# Altium project plp-cd(4-20).PrjPcb
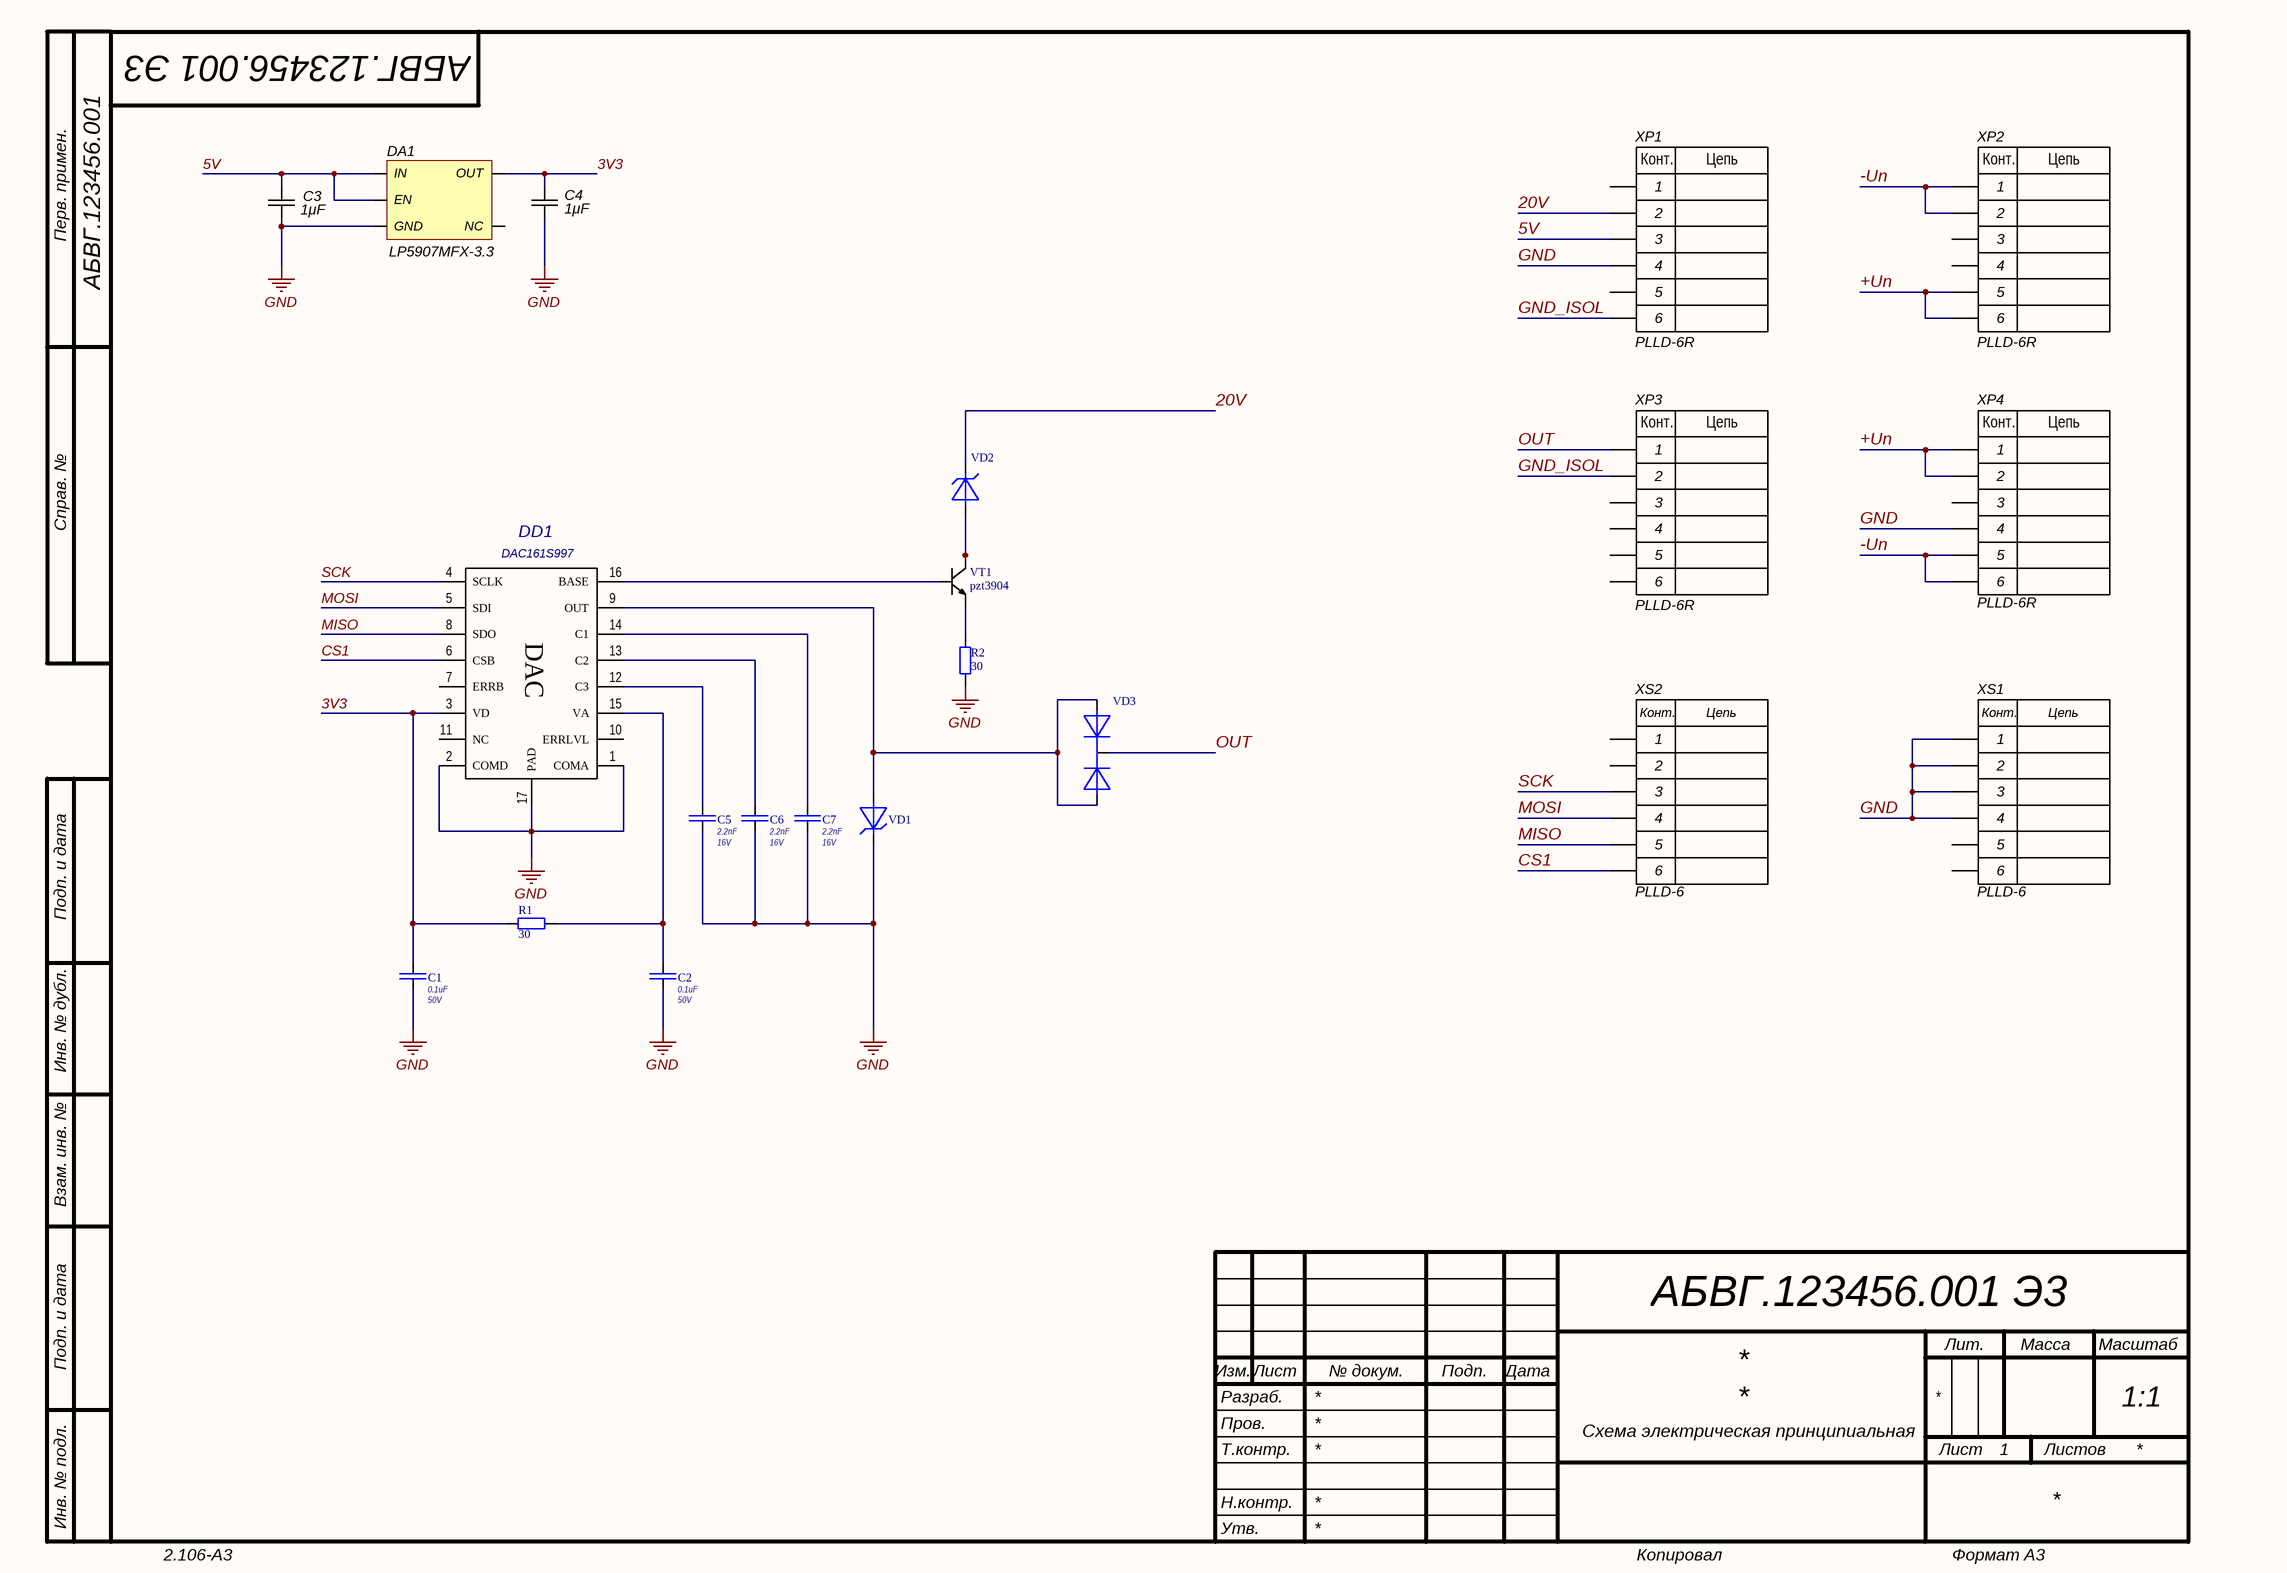
[diagram p0: plp-cd(4-20).SchDoc]
1 sheet, 21 parts. Net scope: global (net labels, ports and power ports of the same name join across sheets).
Board file: plp-cd(4-20).PcbDoc

## Sheet plp-cd(4-20).SchDoc
size 420 x 297 mm; Address1: Address1; Address2: Address2; Address3: Address3; Address4: Address4; DocumentNumber: АБВГ.123456.001 Э3; SheetNumber: 1; Scale: 1:1; DocumentType: Схема электрическая принципиальная; FirstReferrence: АБВГ.123456.001

### Parts
C1  Rated DC Voltage: 50V  [CAPC_0603(1608)X080L]  (hidden comment: 0.1uF)
C2  Rated DC Voltage: 50V  [CAPC_0603(1608)X080L]  (hidden comment: 0.1uF)
C3  value 1μF  [CAP: 0603]
C4  value 1μF  [CAP: 0603]
C5  Rated DC Voltage: 16V  [CAPC_0603(1608)X080L]  (hidden comment: 2.2nF)
C6  Rated DC Voltage: 16V  [CAPC_0603(1608)X080L]  (hidden comment: 2.2nF)
C7  Rated DC Voltage: 16V  [CAPC_0603(1608)X080L]  (hidden comment: 2.2nF)
DA1  LP5907MFX-3.3  [SOT23-5]
DD1  DAC161S997  [WQFN-16]
R1  30  [RESC1608(0603)X04L]
R2  30  [RESC1608(0603)X04L]
VD1  SM2T3V3A  [DO216-AA]  (value not drawn)
VD2  SM2T  [DO216-AA]  (value not drawn)
VD3  BAV70W  [SC-70]  (value not drawn)
VT1  pzt3904  [SOT223]
XP1  PLLD-6R  [CON: PLL-6(2x3R1.27male)]
XP2  PLLD-6R  [CON: PLL-6(2x3R1.27male)]
XP3  PLLD-6R  [CON: PLL-6(2x3R1.27male)]
XP4  PLLD-6R  [CON: PLL-6(2x3R1.27male)]
XS1  PLLD-6  [CON: PLL-6(2x3R1.27female)]
XS2  PLLD-6  [CON: PLL-6(2x3R1.27female)]

### Nets
GND: C1.1 C2.1 C3.1 C4.1 C5.1 C6.1 C7.1 DA1.2(GND) DD1.1(COMA) DD1.2(COMD) DD1.17(PAD) R2.2 VD1.2(C) XP1.4 XP4.4 XS1.1 XS1.2 XS1.3 XS1.4
3V3: C1.2 C4.2 DA1.5(OUT) DD1.3(VD) R1.1
5V: C3.2 DA1.1(IN) DA1.3(EN) XP1.3
20V: VD2.1(C) XP1.2
+Uп: XP2.5 XP2.6 XP4.1 XP4.2
-Uп: XP2.1 XP2.2 XP4.5 XP4.6
CS1: DD1.6(CSB) XS2.6
GND_ISOL: XP1.6 XP3.2
MISO: DD1.8(SDO) XS2.5
MOSI: DD1.5(SDI) XS2.4
OUT: VD3.3(OC) XP3.1
SCK: DD1.4(SCLK) XS2.3
NetC2_2: C2.2 DD1.15(VA) R1.2
NetC5_2: C5.2 DD1.12(C3)
NetC6_2: C6.2 DD1.13(C2)
NetC7_2: C7.2 DD1.14(C1)
NetDD1_9: DD1.9(OUT) VD1.1(A) VD3.1(A) VD3.2(A)
NetDD1_16: DD1.16(BASE) VT1.1(Base)
NetR2_1: R2.1 VT1.3(Emitter)
NetVD2_2: VD2.2(A) VT1.2(Collector) VT1.4(Collector)

Not connected (* = marked no-connect by the designer): DA1 4(NC); DD1 7(ERRB) 10(ERRLVL) 11(NC); XP1 1 5; XP2 3 4; XP3 3 4 5 6; XP4 3; XS1 5 6; XS2 1 2

### Notes on the sheet
- При трассировке
  переименовать  xs2/xs3
- Перв. примен.
- Справ. №
- Подп. и дата
- Инв. № дубл.
- Взам. инв. №
- Разраб.
- Изм.
- Лист
- № докум.
- Подп.
- Дата
- Лит.
- Масса
- Масштаб
- Пров.
- Т.контр.
- Листов
- Инв. № подл.
- Утв.
- Н.контр.
- 2.106-A3
- Копировал
- Формат А3
- (in symbol DAC161S997) DAC
- (in symbol PLLD-6(Female)) Конт.; Цепь
- (in symbol PLLD-6R(Male)) Конт.; Цепь

### Library data of the parts
C1 C2 C5-C7 = Capacitor Ceramic: Конденсатор; Manufacturer: Murata; PartNumber: 0603 - 0,1 мкФ ± 10 % - 50 В - X7R; ReplacementPart1Manufacturer: TDK; ReplacementPart2Manufacturer: Taiyo Yuden; TC Code: X7R; Tolerance: ±10%; Case: 0603; ComponentLink1Description: Global Data; ComponentLink1URL: http://www.murata.com/products/capacitor/tech_data/index.html; ComponentLink2Description: Part Data Sheet; ComponentLink2URL: *; ComponentLink3Description: Replacement Data Sheet; ComponentLink3URL: *; ComponentLink4Description: Replacement 2 Data Sheet; ComponentLink4URL: *; ReplacementPart1PartNumber: *; ReplacementPart2PartNumber: *; Ripple Current Rating: *; Temperature Range: -55 to +125°C
  C1 C2: Value: 0.1uF
  C5-C7: Value: 2.2nF
C3 C4 = Ceramic_0603: Manufacturer: Yageo; PartNumber: CC0603KRX7R7BB104; ValueManufacturerPartNumber: Ceramic capacitor, 1μF, X7R, ±10%, 16V, 0603, -55...+125°C; TypeCapacitor: Ceramic capacitor; Tolerance: ±10%; TypeDielectric: X7R; Voltage: 16V; Package: 0603; HelpURL: https://www.digikey.com/product-detail/en/yageo/CC0603KRX7R7BB104/311-1088-1-ND/302998; Temperature: -55...+125°C
DA1 = LP5907MFX-3.3: LDO 250 mA
R1 R2 = R0603L: Резистор; Manufacturer: Bourns; PartNumber: 0603 - {Value} Ом ± 1 %; Max Rated DC Voltage: 100 В; Power: 1/10 Вт; Rated DC Voltage: 50 В; Rated T: -55 °C to +125 °C; TKR: ±100 ppm; Tolerance: ±1 %; Value: 10k; ComponentLink1Description: Data Sheet; ComponentLink1URL: http://smd.ru/files/upload/1207/ru/chip-resis.pdf; Case: 0603; ComponentLink2Description: Specific Res Only; ComponentLink2URL: *; ComponentLink3Description: Replacement Data Sheet; ComponentLink3URL: *; ComponentLink4Description: Replacement 2 Data Sheet; ComponentLink4URL: *; ReplacementPart1Manufacturer: *; ReplacementPart1PartNumber: *; ReplacementPart2Manufacturer: *; ReplacementPart2PartNumber: *; Temperature Range: -55 to +125°C
VD1 = SM2T3V3A: TVS Диод; Manufacturer: ST Microelectronics; ComponentLink1Descriprion: Data Sheet; ComponentLink1URL: *; ComponentLink2Description: Replacement 1 Data Sheet; ComponentLink2URL: *; ComponentLink3Description: Replacement 2 Data Sheet; ComponentLink3URL: *; PartNumber: *; ReplacementPart1Manufacturer: *; ReplacementPart1PartNumber: *; ReplacementPart1TopMarking: *; ReplacementPart2Manufacturer: *; ReplacementPart2TopMarking: *; TopMarking: *; ReplacementPart2PartNumber: *; StandOffVoltage: *
VD2 = SM2T: TVS Диод; Manufacturer: ST Microelectronics; ComponentLink1Descriprion: Data Sheet; ComponentLink1URL: *; ComponentLink2Description: Replacement 1 Data Sheet; ComponentLink2URL: *; ComponentLink3Description: Replacement 2 Data Sheet; ComponentLink3URL: *; PartNumber: *; ReplacementPart1Manufacturer: *; ReplacementPart1PartNumber: *; ReplacementPart1TopMarking: *; ReplacementPart2Manufacturer: *; ReplacementPart2TopMarking: *; TopMarking: *; ReplacementPart2PartNumber: *; StandOffVoltage: *
VD3 = BAV70W: Сборка диодная; Manufacturer: NXP; Package: SC-70; PartNumber: BAV70W; ComponentLink1Description: DataSheet; ComponentLink1URL: *; Power/Voltage: *; Type: *; ComponentLink2URL: *; ComponentLink3Description: Replacement2DataSheet; ComponentLink3URL: *; ComponentLink2Description: Replacement1DataSheet; ReplacementPart2TopMarking: *; ReplacementPart1Manufacturer: *; ReplacementPart1PartNumber: *; ReplacementPart1TopMarking: *; ReplacementPart2Manufacturer: *
VT1 = pzt3904: Транзистор; Manufacturer: Fairchild Semiconductor; ReplacementPart1Manufacturer: ON Semiconductor; ReplacementPart2Manufacturer: ST Microelectronics; ComponentLink1Description: Data Sheet; ComponentLink1URL: http://www.fairchildsemi.com/ds/MJ/MJD31C.pdf; ComponentLink2Description: Replacement 1 Data Sheet; ComponentLink2URL: http://www.onsemi.com/pub/Collateral/MJD31-D.PDF; ComponentLink3Description: Replacement 2 Data Sheet; ComponentLink3URL: http://www.st.com/internet/com/TECHNICAL_RESOURCES/TECHNICAL_LITERATURE/DATASHEET/CD00000831.pdf; PartNumber: pzt3904; ReplacementPart1PartNumber: pzt3904; ReplacementPart2PartNumber: pzt3904
XP1-XP4 = PLLD-6R(Male): Step 1.27 R
XS1 XS2 = PLLD-6(Female): Step 1.27